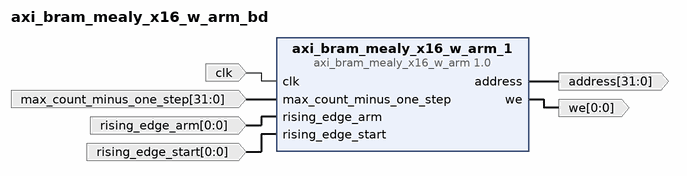
[diagram p0: block diagram of the top level]
# Vivado block design axi_bram_mealy_x16_w_arm_bd, xczu28dr-ffvg1517-2-e, Vivado 2020.2
create_bd_design axi_bram_mealy_x16_w_arm_bd

create_bd_port -dir O -from 31 -to 0 -type data address
create_bd_port -dir I -type clk clk
create_bd_port -dir I -from 31 -to 0 -type data max_count_minus_one_step
create_bd_port -dir I -from 0 -to 0 -type data rising_edge_arm
create_bd_port -dir I -from 0 -to 0 -type data rising_edge_start
create_bd_port -dir O -from 0 -to 0 -type data we

create_bd_cell -type ip -vlnv User_Company:SysGen:axi_bram_mealy_x16_w_arm:1.0 axi_bram_mealy_x16_w_arm_1

# ---- connections ----

connect_bd_net [get_bd_pins axi_bram_mealy_x16_w_arm_1/address] [get_bd_ports address]
connect_bd_net [get_bd_ports clk] [get_bd_pins axi_bram_mealy_x16_w_arm_1/clk]
connect_bd_net [get_bd_ports max_count_minus_one_step] [get_bd_pins axi_bram_mealy_x16_w_arm_1/max_count_minus_one_step]
connect_bd_net [get_bd_ports rising_edge_arm] [get_bd_pins axi_bram_mealy_x16_w_arm_1/rising_edge_arm]
connect_bd_net [get_bd_ports rising_edge_start] [get_bd_pins axi_bram_mealy_x16_w_arm_1/rising_edge_start]
connect_bd_net [get_bd_pins axi_bram_mealy_x16_w_arm_1/we] [get_bd_ports we]

validate_bd_design
save_bd_design
